# EAGLE design LiPoBatteryBreakout (EAGLE 8.2.2)
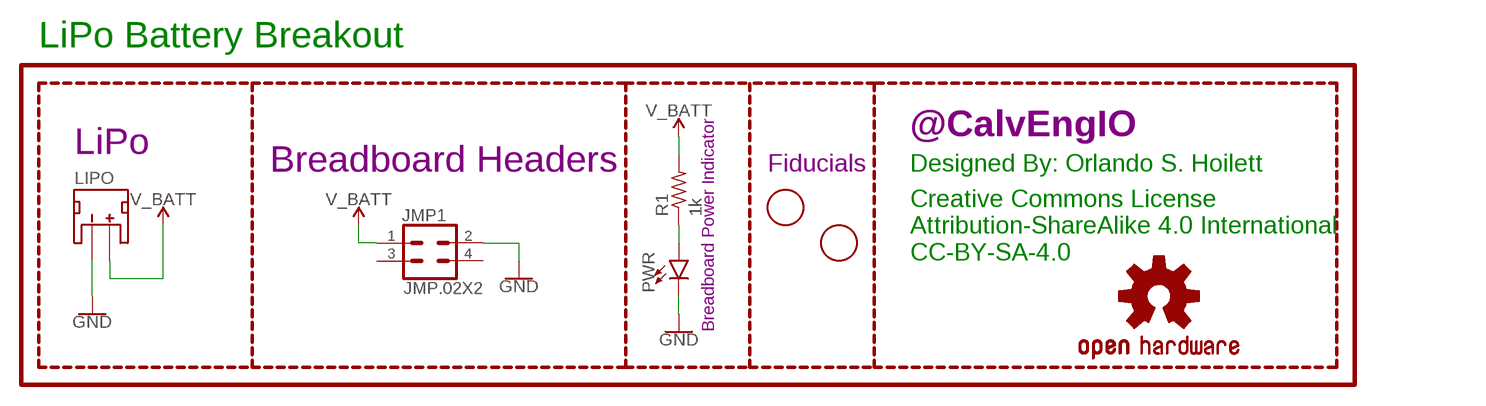
[diagram p0: schematic, sheet 1]

## Parts
FD1  FIDUCIAL  [FIDUCIAL_1MM]
FD2  FIDUCIAL  [FIDUCIAL_1MM]
JMP1  JMP.02X2  [JMP.02X2]
LIPO  JST_2MM_MALE  [JST-2-SMD]
LOGO1  OSHW-LOGOS  [OSHW-LOGO-S]
PWR  LED0603  [LED-0603]
R1  1k  R-US_R0402  [R0402]
U$2  LOGO.05  [LOGO.05]

## Nets
GND: JMP1.2 LIPO.1(-) PWR.C
N$2: PWR.A R1.1
V_BATT: JMP1.1 LIPO.2(+) R1.2
Unconnected: JMP1.3 JMP1.4 LIPO.NC1(PAD1) LIPO.NC2(PAD2)

## Notes on the sheet
- LiPo Battery Breakout
- LiPo
- Breadboard Headers | Fiducials | Designed By: Orlando S. Hoilett
- Creative Commons License
  Attribution-ShareAlike 4.0 International
  CC-BY-SA-4.0
- Breadboard Power Indicator

## Library data of the parts
FD1 FD2 = adafruit:FIDUCIAL: For use by pick and place machines to calibrate the vision/machine, 1mm By microbuilder.eu
JMP1 = CalvEngIO-Connectors:JMP.02X2
LIPO = SparkFun-Connectors:JST_2MM_MALE: JST 2MM MALE RA CONNECTOR Two pin, compact surface mount connector. Commonly used as a battery input connection point. We really like the solid locking feeling and high current rating on these small connectors. We use these all the time as battery connectors. Mates to single-cell LiPo batteries. Here is the connector we sell at SparkFun: JST Right Angle Connector - White <https://www.sparkfun.com/products/8612> (PRT-08612) Datasheet <http://www.sparkfun.com/datasheets/Prototyping/Connectors/JST-Horizontal.pdf> It was used on these SparkFun products: SparkFun MOSFET Power Controller <https://www.sparkfun.com/products/11214> (PRT-11214) SparkFun Battery Babysitter - LiPo Battery Manager <https://www.sparkfun.com/products/13777> (PRT-13777) And many, many others that required a lipo battery connection.; PROD_ID: CONN-11443; SF_ID: PRT-08612
LOGO1 = SparkFun-Aesthetics:OSHW-LOGO: Open-Source Hardware (OSHW) Logo This logo indicates the piece of hardware it is found on incorporates a OSHW license and/or adheres to the definition of open source hardware found here: http://freedomdefined.org/OSHW
PWR = CalvEngIO-LED:LED: LED (Generic) Standard schematic elements and footprints for 5mm, 3mm, 1206, and 0603 sized LEDs. Generic LEDs with no color specified.
R1 = resistor:R-US_: RESISTOR, American symbol
U$2 = CalvEngIO-Logos:LOGO.05

## Board
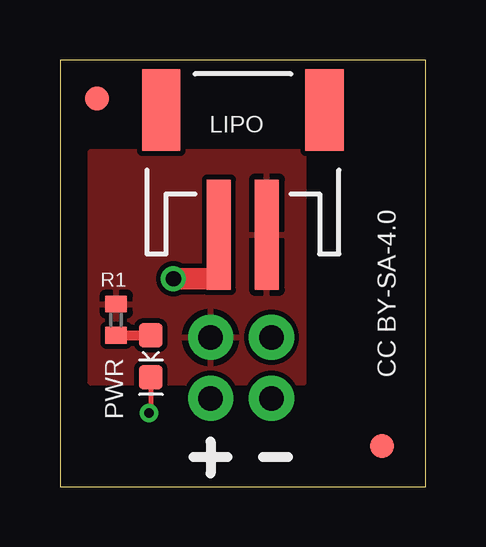
[diagram p1: board, top side]
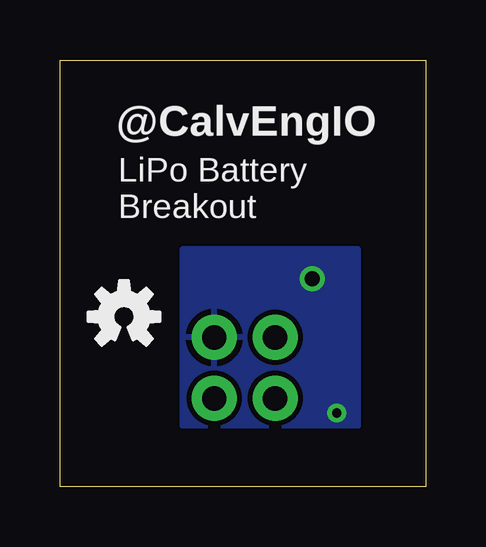
[diagram p2: board, bottom side, seen from below]

Size 15.24 x 17.78 mm. Coordinates in mm from the lower left corner, seen from the top.
Outline: 0,0 15.24,0 15.24,17.78 0,17.78 0,0
Copper layers (1*16): Top 0.035mm / dielectric 1.5mm / Bottom 0.035mm
Design rules "default": minimum track width 10mil, minimum drill 24mil, track to track 8mil, track to pad 8mil, pad to pad 8mil, via to via 8mil, smd to smd 8mil, copper to edge 40mil, drill to drill 8mil, minimum pad ring 10mil, minimum via ring 8mil, stop-mask expansion 4mil, vias tented up to drill 0mil, thermal gap 10mil

### Footprints (pad centres in the part's own frame; a part is rotated, then mirrored left to right if it is on the bottom)
FIDUCIAL_1MM = smd 1 x 1: 1 0,0
JMP.02X2 = drill 1.016 pad 1.88: 1 -1.27,1.27; 2 1.27,1.27; 3 -1.27,-1.27; 4 1.27,-1.27
JST-2-SMD = smd 1 x 4.6: 1 -1,-3.7; 2 1,-3.7 | smd 1.6 x 3.4: NC1 -3.4,1.5; NC2 3.4,1.5
LED-0603 = smd 1 x 1: A -0.877,0; C 0.877,0
R0402 = smd 0.7 x 0.9: 1 -0.65,0; 2 0.65,0

### Placement (x,y rotation side)
FD1  1.55,16.18 0 top
FD2  13.41,1.7 0 top
JMP1  7.54,4.95 0 top
LIPO  7.62,14.2 0 top
LOGO1  12.57,7.09 0 bottom
PWR  3.78,5.44 270 top
R1  2.34,6.96 90 top
U$2  7.82,14.61 0 bottom

### Tracks (layer width: path | path; a pad name or v marks a point on that pad's centre or on a via)
GND  (via drill 0.38, 0.64)
  Top 0.203: PWR.C 3.79,3.15 v3.71,3.07
  Top 0.889: v4.72,8.66 6.3,8.66 6.63,8.99 LIPO.1
  pour Bottom (isolate 0.203): 2.79,9.91 10.16,9.91 10.16,2.54 2.79,2.54
N$2
  Top 0.406: R1.1 PWR.A
V_BATT
  pour Top (isolate 0.203): 1.27,13.97 10.16,13.97 10.16,4.32 1.27,4.32

### Text on the board
tPlace: CC BY-SA-4.0 | PWR
bNames: LiPo Battery / Breakout